# EAGLE design latch (EAGLE 8.2.2)
IMD and BMS latching board.
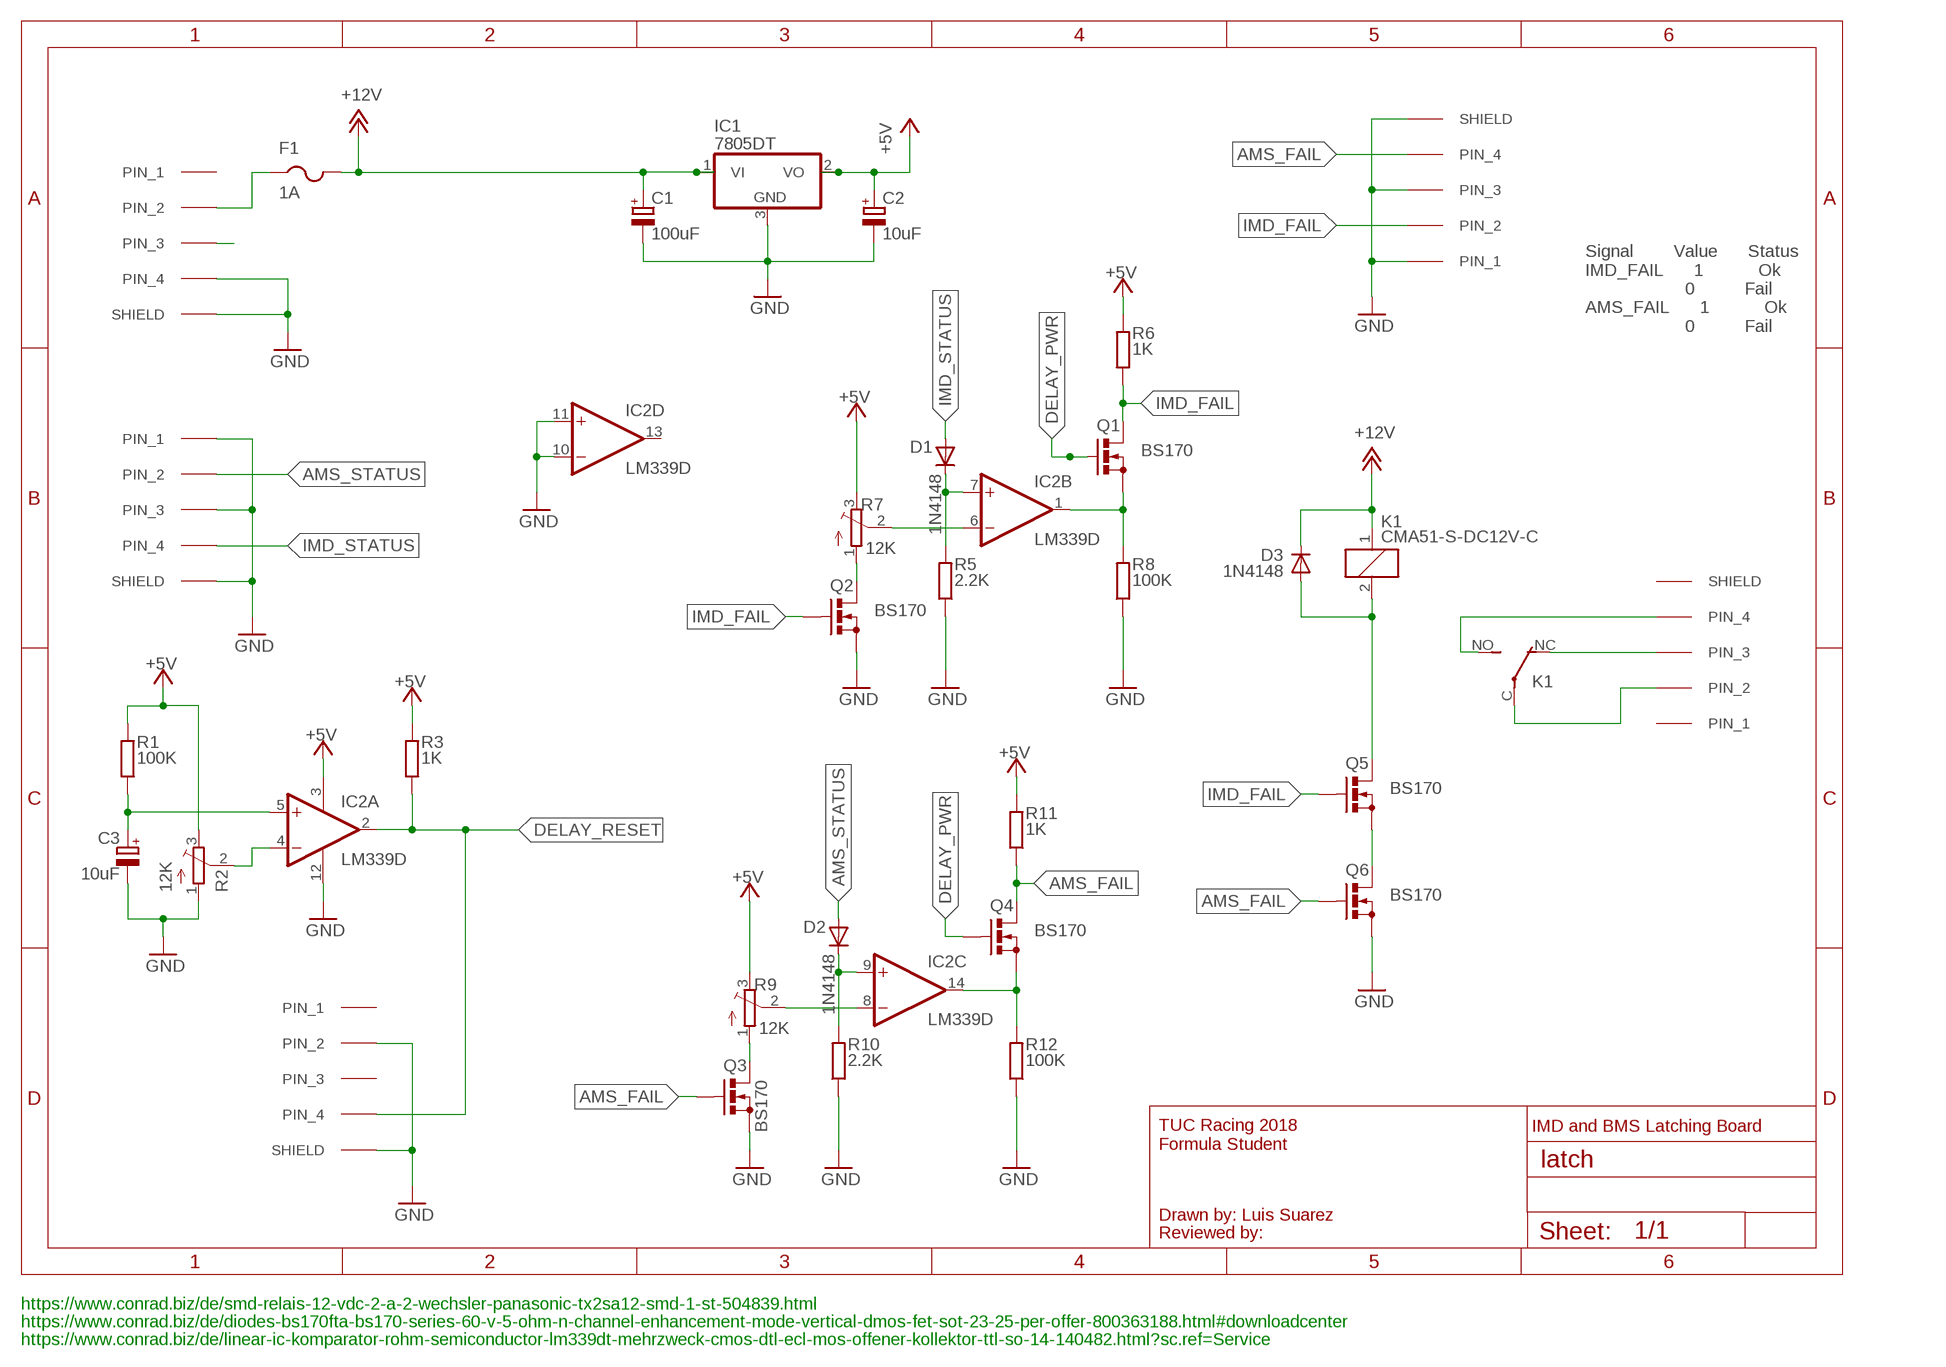
[diagram p0: schematic, sheet 1]

## Parts
C1  100uF  CPOL-EUD  [PANASONIC_D]
C2  10uF  CPOL-EUC  [PANASONIC_C]
C3  10uF  CPOL-EUC  [PANASONIC_C]
D1  1N4148  DIODE-GF1  [GF1]
D2  1N4148  DIODE-GF1  [GF1]
D3  1N4148  DIODE-DO-214AC  [DO-214AC]
F1  1A  PTCFUSE-1206  [R1206]
IC1  7805DT  [TO252]
IC2  LM339D  [SO14]
INDICATORS  M8-718-FEMALE  [M18-718-FEMALE]
K1  CMA51-S-DC12V-C  CQ1-12V  [CQ1]
LATCH  M8-718-MALE  [M18-718-MALE]
POWER_CONN  POWER  M8-718-MALE  [M18-718-MALE]
Q1  BS170  BS170FTA  [SOT96P240X100-3N]
Q2  BS170  BS170FTA  [SOT96P240X100-3N]
Q3  BS170  BS170FTA  [SOT96P240X100-3N]
Q4  BS170  BS170FTA  [SOT96P240X100-3N]
Q5  BS170  BS170FTA  [SOT96P240X100-3N]
Q6  BS170  BS170FTA  [SOT96P240X100-3N]
R1  100K  R-EU_R0805  [R0805]
R2  12K  TRIM_EU-SM-42/43B  [SM-42/43B]
R3  1K  R-EU_R0805  [R0805]
R5  2.2K  R-EU_R0805  [R0805]
R6  1K  R-EU_R0805  [R0805]
R7  12K  TRIM_EU-SM-42/43B  [SM-42/43B]
R8  100K  R-EU_R0805  [R0805]
R9  12K  TRIM_EU-SM-42/43B  [SM-42/43B]
R10  2.2K  R-EU_R0805  [R0805]
R11  1K  R-EU_R0805  [R0805]
R12  100K  R-EU_R0805  [R0805]
RESET  M8-718-FEMALE  [M18-718-FEMALE]
STATUS  M8-718-MALE  [M18-718-MALE]

## Nets
+5V: C2.+ IC1.2(VO) IC2.3(P:V+) R1.2 R2.3(E) R3.2 R6.2 R7.3(E) R9.3(E) R11.2
+12V: C1.+ D3.C F1.2 IC1.1(VI) K1.1
AMS_FAIL: INDICATORS.P$4(PIN_4) Q3.1(G) Q4.3(D) Q6.1(G) R11.1
AMS_STATUS: D2.A STATUS.P$2(PIN_2)
DELAY_PWR: Q1.1(G) Q4.1(G)
DELAY_RESET: IC2.2(A:OUT) R3.1 RESET.P$4(PIN_4)
GLV+: F1.1 POWER_CONN.P$2(PIN_2)
GND: C1.- C2.- C3.- IC1.3(GND) IC2.10(D:-IN) IC2.11(D:+IN) IC2.12(P:GND) INDICATORS.L(SHIELD) INDICATORS.P$1(PIN_1) INDICATORS.P$3(PIN_3) INDICATORS.R(SHIELD) POWER_CONN.L(SHIELD) POWER_CONN.P$4(PIN_4) POWER_CONN.R(SHIELD) Q2.2(S) Q3.2(S) Q6.2(S) R2.1(A) R5.1 R8.1 R10.1 R12.1 RESET.L(SHIELD) RESET.P$2(PIN_2) RESET.R(SHIELD) STATUS.L(SHIELD) STATUS.P$1(PIN_1) STATUS.P$3(PIN_3) STATUS.R(SHIELD)
IMD_FAIL: INDICATORS.P$2(PIN_2) Q1.3(D) Q2.1(G) Q5.1(G) R6.1
IMD_STATUS: D1.A STATUS.P$4(PIN_4)
LATCH+: K1.NO(2:S) LATCH.P$4(PIN_4)
LATCH-: K1.C(2:P) LATCH.P$2(PIN_2)
N$2: IC2.4(A:-IN) R2.2(S)
N$3: C3.+ IC2.5(A:+IN) R1.1
N$5: D1.C IC2.7(B:+IN) R5.2
N$6: IC2.6(B:-IN) R7.2(S)
N$7: Q2.3(D) R7.1(A)
N$8: D2.C IC2.9(C:+IN) R10.2
N$9: IC2.1(B:OUT) Q1.2(S) R8.2
N$10: IC2.8(C:-IN) R9.2(S)
N$11: Q3.3(D) R9.1(A)
N$12: IC2.14(C:OUT) Q4.2(S) R12.2
N$13: D3.A K1.2 Q5.3(D)
N$14: Q5.2(S) Q6.3(D)
N$15: POWER_CONN.P$3(PIN_3)
N$16: K1.NC(2:O) LATCH.P$3(PIN_3)
Unconnected: IC2.13(D:OUT) LATCH.L(SHIELD) LATCH.P$1(PIN_1) LATCH.R(SHIELD) POWER_CONN.P$1(PIN_1) RESET.P$1(PIN_1) RESET.P$3(PIN_3)

## Notes on the sheet
- Signal        Value      Status
  IMD_FAIL      1           Ok
                      0          Fail
  AMS_FAIL      1           Ok
                      0          Fail
- IMD and BMS Latching Board
- TUC Racing 2018
  Formula Student
- Drawn by: Luis Suarez
- Reviewed by:
- https://www.conrad.biz/de/smd-relais-12-vdc-2-a-2-wechsler-panasonic-tx2sa12-smd-1-st-504839.html
- https://www.conrad.biz/de/diodes-bs170fta-bs170-series-60-v-5-ohm-n-channel-enhancement-mode-vertical-dmos-fet-sot-23-25-per-offer-800363188.html#downloadcenter
- https://www.conrad.biz/de/linear-ic-komparator-rohm-semiconductor-lm339dt-mehrzweck-cmos-dtl-ecl-mos-offener-kollektor-ttl-so-14-140482.html?sc.ref=Service

## Library data of the parts
C1-C3 = rcl:CPOL-EU: POLARIZED CAPACITOR, European symbol
D1-D3 = diode:DIODE-: DIODE
F1 = adafruit:PTCFUSE: PTC fuses, resettable thermistors
IC1 = linear:78*: Positive VOLTAGE REGULATOR Source: http://cache.national.com/ds/LM/LM78L05.pdf http://www.fairchildsemi.com/ds/LM/LM7805.pdf
IC2 = linear:LM339: Low Power Low Offset Voltage Quad Comparators with open collector; LM139/LM239/LM339/LM2901/LM3302
INDICATORS RESET = SamacSys_Parts:M8-718-FEMALE
K1 = relay:CQ1-12V: AUTOMOTIVE QUIET RELAY NAiS Source: http://www.mew-europe.com/.. en_ds_61208_0000.pdf; OC_FARNELL: unknown; OC_NEWARK: unknown
LATCH POWER_CONN STATUS = SamacSys_Parts:M8-718-MALE
Q1-Q6 = SamacSys_Parts:BS170FTA: MOSFET N-Channel 60V 0.00015A SOT23 Diodes Inc BS170FTA N-channel MOSFET Transistor, 0.00015 A, 60 V, 3-Pin SOT-23 <https://componentsearchengine.com/Images/1/BS170FTA.jpg> Source: Datasheet <http://uk.rs-online.com/webdocs/00af/0900766b800af6ad.pdf>; DESCRIPTION: MOSFET N-Channel 60V 0.00015A SOT23 Diodes Inc BS170FTA N-channel MOSFET Transistor, 0.00015 A, 60 V, 3-Pin SOT-23; HEIGHT: 1mm; MANUFACTURER_NAME: Diodes Inc.; MANUFACTURER_PART_NUMBER: BS170FTA; RS_PART_NUMBER: 2156587P; SUPPLIER_NAME: RS
R1 R3 R5 R6 R8 R10-R12 = rcl:R-EU_: RESISTOR, European symbol
R2 R7 R9 = pot:TRIM_EU-: POTENTIOMETER

## Board
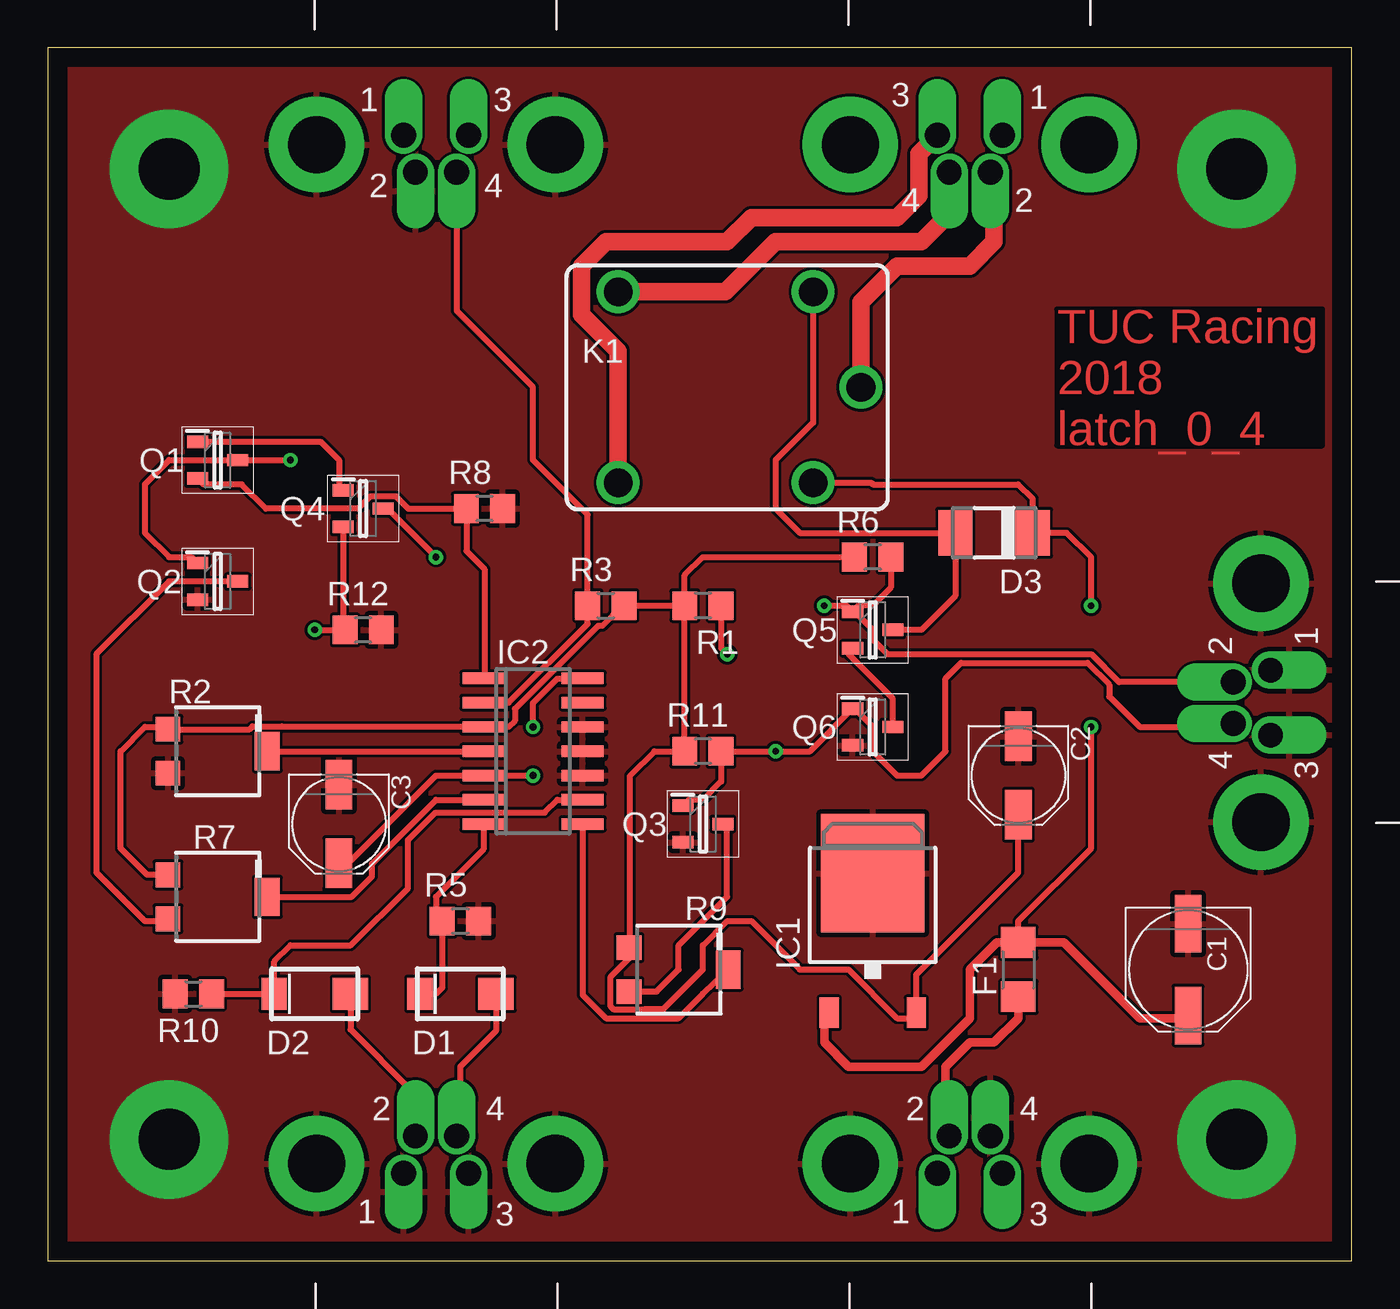
[diagram p1: board, top side]
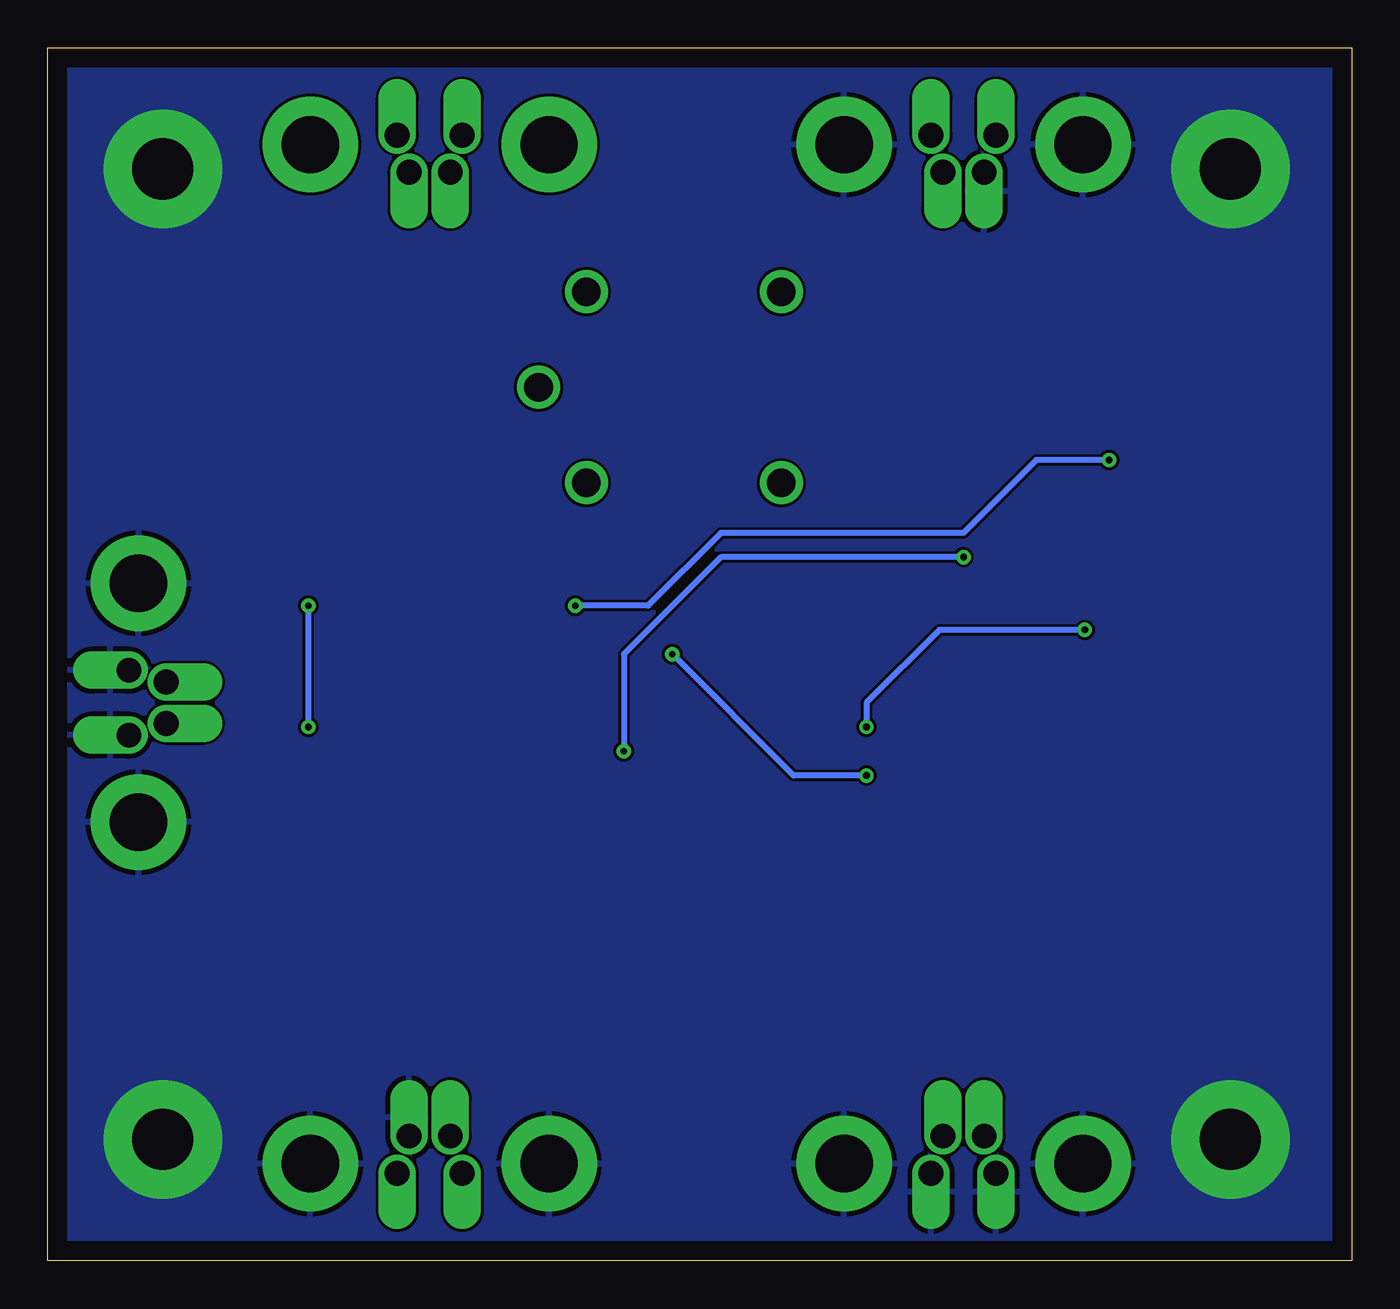
[diagram p2: board, bottom side, seen from below]

Size 68.25 x 63.49 mm. Coordinates in mm from the lower left corner, seen from the top.
Outline: 0,63.49 0,0 68.25,0 68.25,63.49 0,63.49
Copper layers (1*16): Top 0.035mm / dielectric 1.5mm / Bottom 0.035mm
Design rules "default": minimum track width 6mil, minimum drill 0.35mm, track to track 6mil, track to pad 6mil, pad to pad 6mil, via to via 6mil, smd to smd 6mil, copper to edge 40mil, drill to drill 6mil, minimum pad ring 10mil, minimum via ring 8mil, stop-mask expansion 4mil, vias tented up to drill 0mil, thermal gap 10mil

### Footprints (pad centres in the part's own frame; a part is rotated, then mirrored left to right if it is on the bottom)
PANASONIC_D = smd 3 x 1.4: + 2.4,0; - -2.4,0
PANASONIC_C = smd 2.6 x 1.4: + 2.05,0; - -2.05,0
GF1 = smd 1.85 x 1.68: A 1.87,0 | smd 1.32 x 1.68: C -2.12,0
DO-214AC = smd 1.8 x 2.4: A 2.025,0; C -2.025,0
R1206 = smd 1.6 x 1.803: 1 -1.422,0; 2 1.422,0
TO252 = smd 1 x 1.6: 1 -2.28,-4.8; 2 2.28,-4.8 | smd 5.4 x 6.2: 3 0,2.5
SO14 = smd 0.6 x 2.2: 1 -3.81,-2.6; 2 -2.54,-2.6; 3 -1.27,-2.6; 4 0,-2.6; 5 1.27,-2.6; 6 2.54,-2.6; 7 3.81,-2.6; 8 3.81,2.6; 9 2.54,2.6; 10 1.27,2.6; 11 0,2.6; 12 -1.27,2.6; 13 -2.54,2.6; 14 -3.81,2.6
M18-718-FEMALE = drill 3 pad 5: L -6.25,0; R 6.25,0 | drill 1.3 pad 1.8 offset: P$1 1.7,-0.5; P$2 1.08,1.45; P$3 -1.7,-0.5; P$4 -1.08,1.45
CQ1 = drill 1.5: 1 4.5,-5; 2 4.5,5; C 7,0; NC -5.7,-5; NO -5.7,5
M18-718-MALE = drill 3 pad 5: L -6.25,0; R 6.25,0 | drill 1.3 pad 1.8 offset: P$1 -1.7,-0.5; P$2 -1.08,1.45; P$3 1.7,-0.5; P$4 1.08,1.45
SOT96P240X100-3N = smd 1.1 x 0.65: 1 -1.05,0.96; 2 -1.05,-0.96; 3 1.05,0
R0805 = smd 1.3 x 1.5: 1 -0.95,0; 2 0.95,0
SM-42/43B = smd 1.3 x 1.3: 1 2.6,1.15; 3 2.6,-1.15 | smd 1.3 x 2: 2 -2.6,0

### Placement (x,y rotation side)
C1  59.69,15.24 270 top
C2  50.8,25.4 270 top
C3  15.24,22.86 270 top
D1  21.59,13.97 0 top
D2  13.97,13.97 0 top
D3  49.53,38.1 180 top
F1  50.8,15.24 90 top
IC1  43.18,17.78 0 top
IC2  25.4,26.67 270 top
INDICATORS  63.5,29.21 90 top
K1  35.56,45.72 0 top
LATCH  48.26,58.42 180 top
POWER_CONN  48.26,5.08 0 top
Q1  8.89,41.91 0 top
Q2  8.89,35.56 0 top
Q3  34.29,22.86 0 top
Q4  16.51,39.37 0 top
Q5  43.18,33.02 0 top
Q6  43.18,27.94 0 top
R1  34.29,34.29 180 top
R2  8.89,26.67 180 top
R3  29.21,34.29 0 top
R5  21.59,17.78 180 top
R6  43.18,36.83 180 top
R7  8.89,19.05 180 top
R8  22.86,39.37 180 top
R9  33.02,15.24 180 top
R10  7.62,13.97 0 top
R11  34.29,26.67 180 top
R12  16.51,33.02 180 top
RESET  20.32,58.42 180 top
STATUS  20.32,5.08 0 top

### Tracks (layer width: path | path; a pad name or v marks a point on that pad's centre or on a via)
+5V
  Top 0.305: R7.3 5.2,20.2 3.81,21.59 3.81,26.67 5.08,27.94 6.17,27.94 R2.3 10.56,27.82 10.71,27.98 12.27,27.98 12.3,27.94 IC2.3 24.13,27.94 24.45,28.26 24.45,28.89 28.8,33.23 29.04,33.23 30.09,34.29 R3.2 R1.2 | 30.48,16.45 30.48,25.4 31.75,26.67 R11.2 R1.2 | 30.48,16.45 R9.3 | C2.+ 50.8,20.32 45.46,14.98 IC1.2 45.18,12.7 44.45,12.7 41.91,15.24 39.37,15.24 36.83,17.78 35.56,17.78 34.29,16.51 34.29,15.24 32.21,13.16 31.22,13.16 31.2,13.13 29.64,13.13 29.46,13.31 29.46,14.87 30.48,15.88 30.48,16.45 | R1.2 33.34,35.88 34.29,36.83 R6.2
+12V  (via drill 0.35)
  Top 0.305: F1.2 50.8,17.78 54.61,21.59 v54.61,27.94 | v54.61,34.29 54.61,36.83 53.34,38.1 D3.C 51.55,39.88 50.8,40.64 43.18,40.64 43.1,40.72 K1.1
  Top 0.457: C1.+ 59.55,12.7 57.15,12.7 53.19,16.66 F1.2 49.68,16.66 48.26,15.24 48.26,12.7 45.72,10.16 41.91,10.16 40.64,11.43 40.64,12.72 IC1.1
  Bottom 0.305: v54.61,34.29 v54.61,27.94
AMS_FAIL  (via drill 0.35)
  Top 0.305: 35.24,26.6 R11.1 35.56,26.99 | 35.24,26.6 35.24,25.08 34.29,24.13 33.55,24.13 Q3.1 | 35.24,26.6 35.31,26.67 v38.1,26.67 39.9,26.67 Q6.1 42.22,28.9 43.18,27.94 43.18,26.67 44.45,25.4 45.72,25.4 46.99,26.67 46.99,30.48 47.8,31.29 54.42,31.29 55.56,30.16 55.56,29.53 57.15,27.94 60.59,27.94 INDICATORS.P$4 | Q4.3 17.78,39.37 v20.32,36.83
  Bottom 0.305: v20.32,36.83 33.02,36.83 38.1,31.75 v38.1,26.67
AMS_STATUS
  Top 0.305: 16.51,13.3 D2.A 15.84,12.1 19.05,8.89 19.05,6.72 STATUS.P$2
DELAY_PWR
  Top 0.305: Q1.1 14.28,42.87 15.24,41.91 15.24,40.55 Q4.1
DELAY_RESET
  Top 0.305: IC2.2 24.13,29.21 28.26,33.34 R3.1 28.26,39.05 26.67,40.64 25.4,41.91 25.4,45.72 21.4,49.72 RESET.P$4
GLV+
  Top 0.457: F1.1 50.8,12.7 49.53,11.43 48.26,11.43 46.99,10.16 46.99,6.72 POWER_CONN.P$2
GND  (via drill 3.2 pad 6.2)
  other vias: 6.35,57.15 62.23,57.15 62.23,6.35 6.35,6.35
  pour Top: 0,0 0,63.5 63.5,63.5 68.58,63.5 68.58,0
  pour Bottom: 0,59.69 0,63.5 68.58,63.5 68.58,3.81 68.58,0 3.81,0 0,0
IMD_FAIL  (via drill 0.35)
  Top 0.305: Q2.1 7.53,36.83 6.35,36.83 5.08,38.1 5.08,40.64 6.35,41.91 Q1.3 v12.7,41.91 | R6.1 44.13,35.24 43.18,34.29 42.44,34.29 Q5.1 | INDICATORS.P$2 56.07,30.29 54.61,31.75 43.94,31.75 43.18,32.51 43.18,33.02 42.22,33.98 Q5.1 | v40.64,34.29 41.82,34.29 Q5.1
  Bottom 0.305: v12.7,41.91 16.51,41.91 20.32,38.1 33.02,38.1 36.83,34.29 v40.64,34.29
IMD_STATUS
  Top 0.305: D1.A 23.46,12.03 21.59,10.16 21.59,6.72 STATUS.P$4
LATCH+
  Top 0.914: K1.NO 35.48,50.72 38.1,53.34 45.72,53.34 46.99,54.61 46.99,56.78 LATCH.P$4
LATCH-
  Top 0.914: K1.C 42.56,50.18 44.45,52.07 48.26,52.07 49.53,53.34 49.53,56.78 LATCH.P$2
N$1
  pour Top: 52.07,41.91 52.07,50.8 66.04,50.8 66.04,41.91
N$2
  Top 0.305: R2.2 IC2.4
N$3  (via drill 0.35)
  Top 0.305: C3.+ 15.24,20.32 20.32,25.4 IC2.5 v25.4,25.4 | R1.1 35.24,32.07 v35.56,31.75
  Bottom 0.305: v25.4,25.4 29.21,25.4 v35.56,31.75
N$5
  Top 0.305: D1.C 20.32,13.97 20.64,14.29 R5.2 20.32,18.1 20.32,19.05 22.8,21.53 IC2.7
N$6
  Top 0.305: R7.2 15.91,19.05 16.97,20.11 16.97,20.78 20.32,24.13 IC2.6
N$7
  Top 0.305: Q2.3 6.35,35.56 2.54,31.75 2.54,20.32 5.08,17.78 6.17,17.78 R7.1
N$8
  Top 0.305: R10.2 D2.C 11.85,15.66 12.7,16.51 15.86,16.51 18.86,19.5 18.86,22.02 20.3,23.46 26,23.46 26.67,24.13 IC2.9
N$9
  Top 0.305: Q1.2 8.15,40.64 10.16,40.64 11.43,39.37 16.25,39.37 16.88,40 18.24,40 18.87,39.37 R8.2 21.91,37.15 22.86,36.2 22.86,30.54 IC2.1
N$10
  Top 0.305: IC2.8 28,13.91 29.21,12.7 33.02,12.7 34.29,13.97 35.56,15.18 R9.2
N$11
  Top 0.305: R9.1 31.87,14.09 33.02,15.24 33.02,16.51 35.56,19.05 35.56,22.64 Q3.3
N$12  (via drill 0.35)
  Top 0.305: Q4.2 15.46,33.12 R12.2 v13.97,33.02 | v25.4,27.94 25.4,29.19 26.68,30.47 27.99,30.47 IC2.14
  Bottom 0.305: v13.97,33.02 21.59,33.02 25.4,29.21 v25.4,27.94
N$13
  Top 0.305: Q5.3 45.72,33.02 47.51,34.8 D3.A 47.51,38.12 47.48,38.1 39.37,38.1 38.1,39.37 38.1,41.91 40.06,43.87 K1.2
N$14
  Top 0.305: Q6.3 44.23,29.43 41.91,31.75 41.91,31.84 Q5.2
N$16
  Top 0.914: K1.NC 29.86,47.61 27.94,49.53 27.94,52.07 29.21,53.34 35.56,53.34 36.83,54.61 44.45,54.61 45.59,55.76 45.59,57.95 LATCH.P$3

### Text on the board
Top: TUC Racing / 2018 / latch_0_4